# EAGLE design PiDAC (EAGLE 7.3.0)
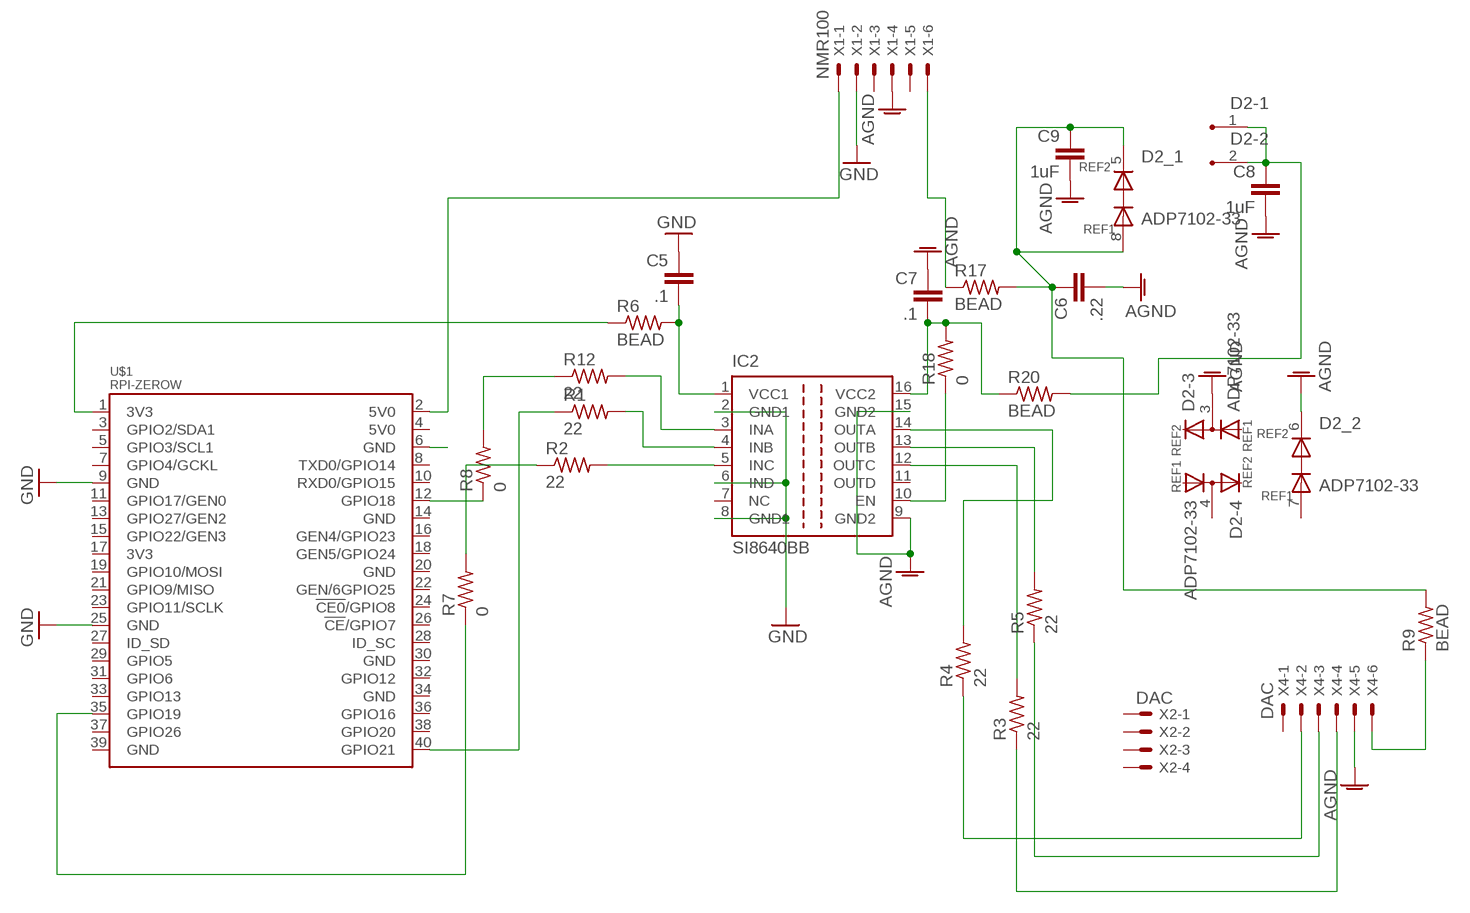
[diagram p0: schematic, sheet 1]

## Parts
C5  .1  C-EUC1210K  [C1210K]
C6  .22  C-EUC1210K  [C1210K]
C7  .1  C-EUC1210K  [C1210K]
C8  1uF  C-EUC1210K  [C1210K]
C9  1uF  C-EUC1210K  [C1210K]
D2  ADP7102-33  DA108S1  [SO08]
IC2  SI8640BB  ISO7240  [SO-16DW]
R1  22  R-US_R1210  [R1210]
R2  22  R-US_R1210  [R1210]
R3  22  R-US_R1210  [R1210]
R4  22  R-US_R1210  [R1210]
R5  22  R-US_R1210  [R1210]
R6  BEAD  R-US_0309/12  [0309/12]
R7  0  R-US_0309/10  [0309/10]
R8  0  R-US_0309/12  [0309/12]
R9  BEAD  R-US_0309/10  [0309/10]
R12  22  R-US_R1210  [R1210]
R17  BEAD  R-US_0309/10  [0309/10]
R18  0  R-US_0309/10  [0309/10]
R20  BEAD  R-US_0309/12  [0309/12]
U$1  RPI-ZEROW  RPI-ZERO  [RASP_PI_ZERO_BOARD_FULL]
X1  NMR100  22-23-2061  [22-23-2061]
X2  DAC  22-23-2041  [22-23-2041]
X4  DAC  22-23-2061  [22-23-2061]

## Nets
3V3@1: R6.1 U$1.1(3V3)
5V0@1: U$1.2(5V0) X1.1
AGND: C6.2 C7.1 C8.2 C9.2 D2.3(-3:K) D2.6(_2:REF2) IC2.9(GND2) IC2.15(GND2) X1.4 X4.5
GND: C5.1 IC2.2(GND1) IC2.6(IND) IC2.8(GND1) U$1.9(GND) U$1.25(GND) X1.2
GND@8: U$1.6(GND)
N$1: R2.1 R7.2
N$2: R3.1 X4.4
N$3: R17.1 X1.6
N$4: R5.1 X4.3
N$5: R4.1 X4.2
N$6: R8.1 U$1.12(GPIO18)
N$7: R7.1 U$1.35(GPIO19)
N$8: R9.1 X4.6
N$10: C5.2 IC2.1(VCC1) R6.2
N$24: R8.2 R12.1
N$25: R1.1 U$1.40(GPIO21)
N$27: IC2.3(INA) R12.2
N$28: IC2.4(INB) R1.2
N$29: IC2.5(INC) R2.2
N$32: C6.1 C9.1 D2.5(_1:REF2) D2.8(_1:REF1) R9.2 R17.2
N$34: IC2.10(EN) R18.1
N$35: C8.1 D2.1(-1:K) D2.2(-2:K) R20.2
N$36: IC2.12(OUTC) R3.2
N$37: IC2.13(OUTB) R5.2
N$38: IC2.14(OUTA) R4.2
N$40: C7.2 IC2.16(VCC2) R18.2 R20.1
Unconnected: D2.4(-4:K) D2.7(_2:REF1) IC2.7(NC) IC2.11(OUTD) U$1.3(GPIO2/SDA1) U$1.4(5V0) U$1.5(GPIO3/SCL1) U$1.7(GPIO4/GCKL) U$1.8(TXD0/GPIO14) U$1.10(RXD0/GPIO15) U$1.11(GPIO17/GEN0) U$1.13(GPIO27/GEN2) U$1.14(GND) U$1.15(GPIO22/GEN3) U$1.16(GEN4/GPIO23) U$1.17(3V3) U$1.18(GEN5/GPIO24) U$1.19(GPIO10/MOSI) U$1.20(GND) U$1.21(GPIO9/MISO) U$1.22(GEN/6GPIO25) U$1.23(GPIO11/SCLK) U$1.24(!CE0!/GPIO8) U$1.26(!CE!/GPIO7) U$1.27(ID_SD) U$1.28(ID_SC) U$1.29(GPIO5) U$1.30(GND) U$1.31(GPIO6) U$1.32(GPIO12) U$1.33(GPIO13) U$1.34(GND) U$1.36(GPIO16) U$1.37(GPIO26) U$1.38(GPIO20) U$1.39(GND) X1.3 X1.5 X2.1 X2.2 X2.3 X2.4 X4.1

## Library data of the parts
C5-C9 = resistor:C-EU: CAPACITOR, European symbol
D2 = st-microelectronics:DA108S1: DIODE ARRAY (ASD); MF: Arrow Electronics; MPN: DA108S1; OC_FARNELL: 9802215; OC_NEWARK: 89K0513
IC2 = texas:ISO7240: HIGH SPEED QUAD DIGITAL ISOLATORS Source: http://focus.ti.com/lit/ds/symlink/iso7240m.pdf; MPN: ISO7240MDW; OC_FARNELL: 1755124; OC_NEWARK: 58M0385
R1-R9 R12 R17 R18 R20 = resistor:R-US_: RESISTOR, American symbol
U$1 = rpi-zero:RPI-ZERO
X1 X4 = con-molex:22-23-2061: .100" (2.54mm) Center Header - 6 Pin; MF: MOLEX; MPN: 22-23-2061; OC_FARNELL: 1462922; OC_NEWARK: 27C1933
X2 = con-molex:22-23-2041: .100" (2.54mm) Center Header - 4 Pin; MF: MOLEX; MPN: 22-23-2041; OC_FARNELL: 1462920; OC_NEWARK: 38C0355

## Board
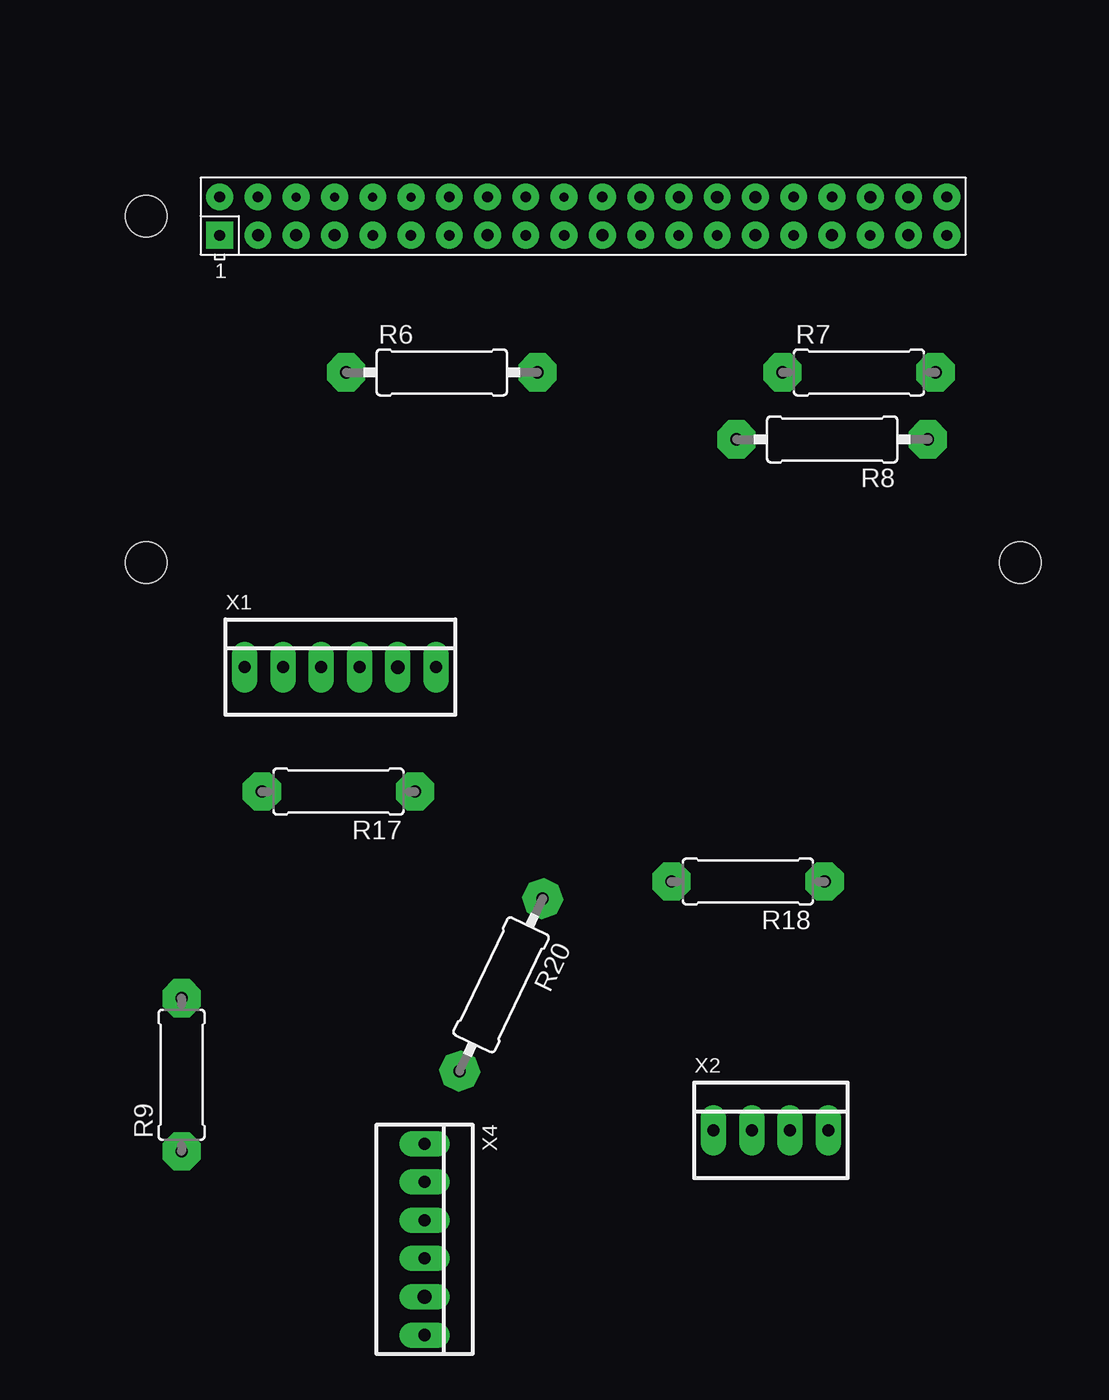
[diagram p1: board, top side]
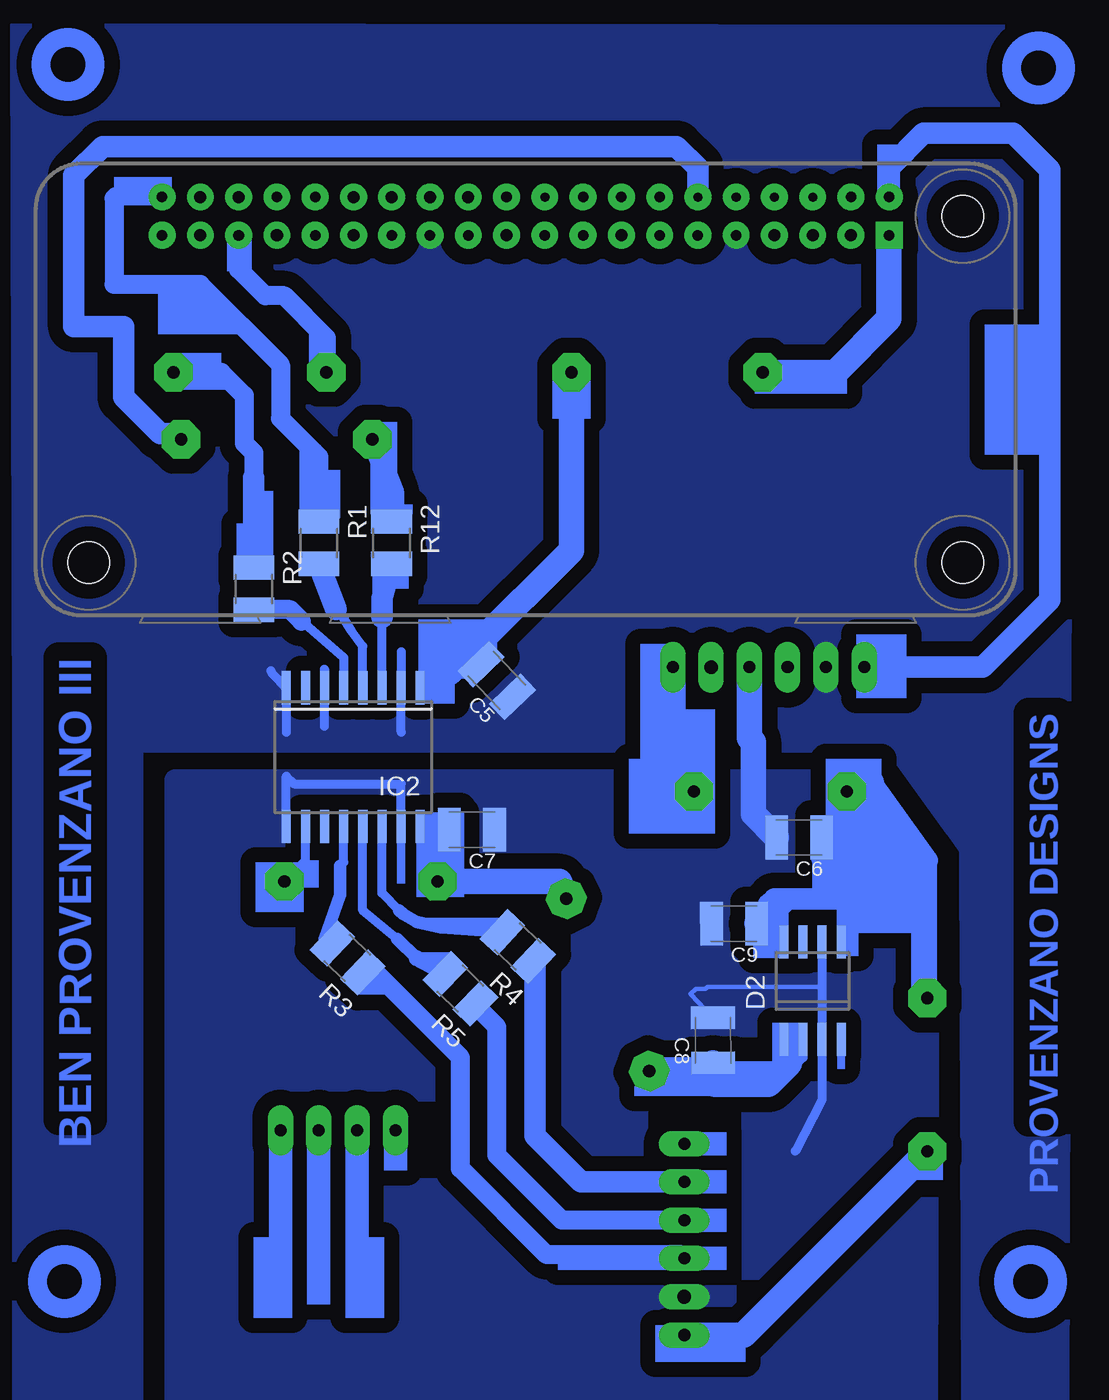
[diagram p2: board, bottom side, seen from below]

No outline drawn. Coordinates in mm, seen from the top.
Copper layers (1*16): Top 0.035mm / dielectric 1.5mm / Bottom 0.035mm
Design rules "default": minimum track width 10mil, minimum drill 24mil, track to track 8mil, track to pad 8mil, pad to pad 8mil, via to via 8mil, smd to smd 8mil, copper to edge 40mil, drill to drill 8mil, minimum pad ring 10mil, minimum via ring 8mil, stop-mask expansion 4mil, vias tented up to drill 0mil, thermal gap 10mil

### Footprints (pad centres in the part's own frame; a part is rotated, then mirrored left to right if it is on the bottom)
C1210K = smd 1.5 x 2.9: 1 -1.5,0; 2 1.5,0
SO08 = smd 0.6 x 2.2: 1 -1.905,-3.87; 2 -0.635,-3.87; 3 0.635,-3.87; 4 1.905,-3.87; 5 1.905,2.6; 6 0.635,2.6; 7 -0.635,2.6; 8 -1.905,2.6
SO-16DW = smd 0.6 x 2.2: 1 -4.445,-4.6; 2 -3.175,-4.6; 3 -1.905,-4.6; 4 -0.635,-4.6; 5 0.635,-4.6; 6 1.905,-4.6; 7 3.175,-4.6; 8 4.445,-4.6; 9 4.445,4.6; 10 3.175,4.6; 11 1.905,4.6; 12 0.635,4.6; 13 -0.635,4.6; 14 -1.905,4.6; 15 -3.175,4.6; 16 -4.445,4.6
R1210 = smd 1.6 x 2.7: 1 -1.4,0; 2 1.4,0
0309/12 = drill 0.813 pad 2.54 octagon: 1 -6.35,0; 2 6.35,0
0309/10 = drill 0.813 pad 2.54 octagon: 1 -5.08,0; 2 5.08,0
RASP_PI_ZERO_BOARD_FULL = drill 0.7 pad 1.778 square: 1 8.37,25.23 | drill 0.7 pad 1.778: 2 8.37,27.77; 4 10.91,27.77; 9 18.53,25.23; 11 21.07,25.23; 13 23.61,25.23; 14 23.61,27.77; 16 26.15,27.77; 17 28.69,25.23; 18 28.69,27.77; 19 31.23,25.23; 22 33.77,27.77; 23 36.31,25.23; 25 38.85,25.23; 27 41.39,25.23; 31 46.47,25.23; 32 46.47,27.77; 34 49.01,27.77; 35 51.55,25.23; 39 56.63,25.23; 40 56.63,27.77 | drill 0.8 pad 1.778: 3 10.91,25.23; 5 13.45,25.23; 7 15.99,25.23; 15 26.15,25.23; 21 33.77,25.23; 24 36.31,27.77; 26 38.85,27.77; 28 41.39,27.77; 29 43.93,25.23; 30 43.93,27.77; 33 49.01,25.23; 36 51.55,27.77; 37 54.09,25.23; 38 54.09,27.77 | drill 0.6 pad 1.778: 6 13.45,27.77; 8 15.99,27.77; 10 18.53,27.77; 12 21.07,27.77; 20 31.23,27.77 | drill 1.3 pad 2.184: P$1 3.482,26.503; P$3 61.488,3.487; P$4 3.495,3.498 | hole 2.75: 3.5,3.5; 3.5,26.5; 61.5,3.5
22-23-2061 = drill 0.8 pad 1.676 long: 1 -6.35,0; 2 -3.81,0; 3 -1.27,0; 4 1.27,0; 6 6.35,0 | drill 0.9 pad 1.676 long: 5 3.81,0
22-23-2041 = drill 0.8 pad 1.676 long: 1 -3.81,0; 2 -1.27,0; 3 1.27,0; 4 3.81,0

### Placement (x,y rotation side)
C5  126.11,69.09 133.8 bottom
C6  106.05,58.67 180 bottom
C7  127.76,59.18 180 bottom
C8  111.76,45.21 90.3 bottom
C9  110.36,52.96 180.2 bottom
D2  105.16,49.15 0 bottom
IC2  135.64,64.01 180 bottom
R1  137.92,78.23 270 bottom
R2  142.24,75.18 270 bottom
R3  136.02,50.67 136.3 bottom
R4  124.71,51.44 136.8 bottom
R5  128.52,48.64 135.6 bottom
R6  114.81,89.53 0 top
R7  142.49,89.53 0 top
R8  140.72,85.09 180 top
R9  97.54,42.93 90 top
R12  133.1,78.23 270 bottom
R17  107.95,61.72 180 top
R18  135.13,55.75 180 top
R20  118.75,48.9 244.3 top
U$1  91.69,73.41 0 top
X1  108.08,69.98 0 top
X2  136.65,39.24 0 top
X4  113.67,32 270 top

### Tracks (layer width: path | path; a pad name or v marks a point on that pad's centre or on a via)
3V3@1
  Bottom 1.676: U$1.1 100.08,98.62 100.08,93.09 103.63,89.53 R6.1
5V0@1
  Bottom 1.422: X1.1 93.85,69.98 89.41,74.42 89.41,103 91.82,105.41 97.79,105.41 100.06,103.14 U$1.2
AGND
  Bottom 0.305: D2.6 104.65,51.62 104.65,48.77 112.14,48.77 112.27,48.64 112.9,48.64 113.26,48.28 C8.2
  Bottom 0.61: IC2.15 132.46,62.23 139.57,62.23 140.08,62.74 IC2.9 | D2.3 104.52,42.67 | D2.6 D2.3 | D2.3 104.52,41.27 106.3,37.85
  Bottom 1.676: X1.4 109.35,65.28 109.09,65.02 109.09,60.22 C6.2
  pour Bottom (isolate 1.016, no thermals): 97.41,62.48 97.54,21.21 147.45,21.21 147.45,62.48
GND
  Bottom 0.61: 141.1,69.72 140.97,69.5 IC2.8 140.08,65.66 | 137.54,66.04 IC2.6 137.54,69.85 | 132.46,65.66 IC2.2 132.46,70.99
  pour Bottom (isolate 1.016, no thermals): 88.01,112.39 158.24,112.52 158.12,64.77 158.12,20.57 149.73,20.7 149.73,64.52 100.08,64.52 96.14,59.05 95.25,57.78 95.12,20.7 88.27,20.57
N$1
  Bottom 1.27: R7.2 144.4,89.53 142.88,88.01 142.88,84.84 142.24,84.2 142.24,82.55
  Bottom 1.422: 142.24,82.55 R2.1
N$2
  Bottom 1.27: X4.4 113.92,30.99 122.81,30.99 128.52,36.7 128.52,44.07 134.16,49.71 R3.1
N$3
  Bottom 1.676: X1.6 114.43,63.12 R17.1
N$4
  Bottom 1.27: X4.3 121.79,33.27 126.11,37.59 126.11,46.1 127.52,47.51 R5.1
N$5
  Bottom 1.422: R4.1 123.57,50.35 123.57,38.86 120.52,35.81 X4.2
N$6
  Bottom 1.422: U$1.12 112.78,101.19 112.78,103.12 114.17,104.52 152.27,104.52 154.18,102.62 154.18,92.58 150.88,92.58 150.88,87.88 148.46,85.47 147.45,85.47 R8.1
N$7
  Bottom 1.27: R7.1 137.41,91.82 140.21,94.61 141.48,94.61 143.24,96.38 U$1.35
N$8
  Bottom 1.676: R9.1 109.73,25.65 X4.6
N$10
  Bottom 0.61: IC2.1 130.2,69.6 129.29,69.6
  Bottom 1.422: 127.51,71.37 127.15,71.02 C5.2
  Bottom 1.676: 129.29,69.6 127.51,71.37 121.16,77.72 R6.2
N$24
  Bottom 1.422: R12.1 132.97,79.76 132.97,81.53 R8.2
N$25
  Bottom 1.27: U$1.40 148.37,101.22 151.38,101.22 151.51,101.09 151.51,95.38 145.8,95.38 140.46,90.04 140.46,86.49 137.92,83.95 R1.1
N$27
  Bottom 0.61: IC2.3 133.73,73.28
  Bottom 1.422: 133.73,73.28 133.73,74.55 R12.2
N$28
  Bottom 0.61: IC2.4 135,71.37 135.76,72.39 136.65,73.79 136.78,73.79
  Bottom 1.422: 136.78,73.79 R1.2
N$29
  Bottom 0.61: IC2.5 136.27,70.61 139.06,73.03
  Bottom 1.27: 139.06,73.03 139.82,73.78 R2.2
N$32
  Bottom 0.406: C6.1 103.76,58.67 103.76,56.77
  Bottom 0.61: D2.5 103.25,54.48 106.93,54.48 107.06,54.36 D2.8
  Bottom 1.422: 106.81,54.61 107.7,54.61 108.08,54.23 108.08,53.34 107.82,53.59 106.81,54.61 | 106.81,54.61 103.38,54.61 103.25,54.48 103,54.48 103,54.61 | 101.35,58.29 102.55,57.09 | 102.55,57.09 102.87,56.77 103.76,56.77 104.52,57.28 103,56.01 103,54.61 | 102.3,57.09 102.55,57.09 | 97.54,57.15 101.23,62.33 101.35,62.48 101.35,62.99 | R9.2 97.92,48.39 97.92,52.96 99.57,54.61 103,54.61
  Bottom 1.676: 107.95,53.68 C9.1 108.34,53.59 107.82,53.59 | 101.23,62.33 102.22,61.34 103,61.34 102.87,61.47 R17.2 101.73,60.58 101.73,58.55 101.85,58.67 103.76,58.67
N$34
  Bottom 0.61: R18.1 138.81,57.15 IC2.10
  Bottom 1.422: R18.1 140.21,55.63 141.35,54.61
N$35
  Bottom 0.61: D2.2 105.79,44.07 106.43,43.43 106.68,43.69 107.06,44.07 | 107.06,44.07 107.19,44.2 107.7,43.18 107.21,42.95 | 107.06,44.07 D2.1
  Bottom 1.676: 106.68,43.69 108.08,42.29 111.63,42.29 | 111.63,42.29 R20.2 | C8.1 111.63,43.21 111.63,42.29
N$36
  Bottom 0.61: 136.53,56.77 136.27,57.02 IC2.12
  Bottom 0.813: 136.53,56.77 136.53,54.86 137.54,51.94 R3.2
N$37
  Bottom 0.61: IC2.13 135,53.85 132.72,51.94
  Bottom 0.813: 131.44,50.67 132.72,51.94
  Bottom 1.016: R5.2 131.44,50.65 131.44,50.67
N$38
  Bottom 0.61: 132.59,53.85 133.73,54.99 IC2.14
  Bottom 0.813: 132.59,53.85 132.33,53.59 131.44,53.09 129.79,52.7 R4.2
N$40
  Bottom 0.61: IC2.16 130.94,59.15 130.94,56.64 130.56,57.02 130.05,57.02
  Bottom 1.422: C7.2 130.05,57.89 130.05,57.02 R18.2 130.05,55.24
  Bottom 1.676: R20.1 121.95,55.75 R18.2
(copper drawn outside any net)
  shapes: Bottom area x107, Bottom circle x4

### Text on the board
Bottom: BEN PROVENZANO III | PROVENZANO DESIGNS